# Altium schematic sheet MainSchematic.SchDoc
size A1; SheetNumber: 1; SheetTotal: 2
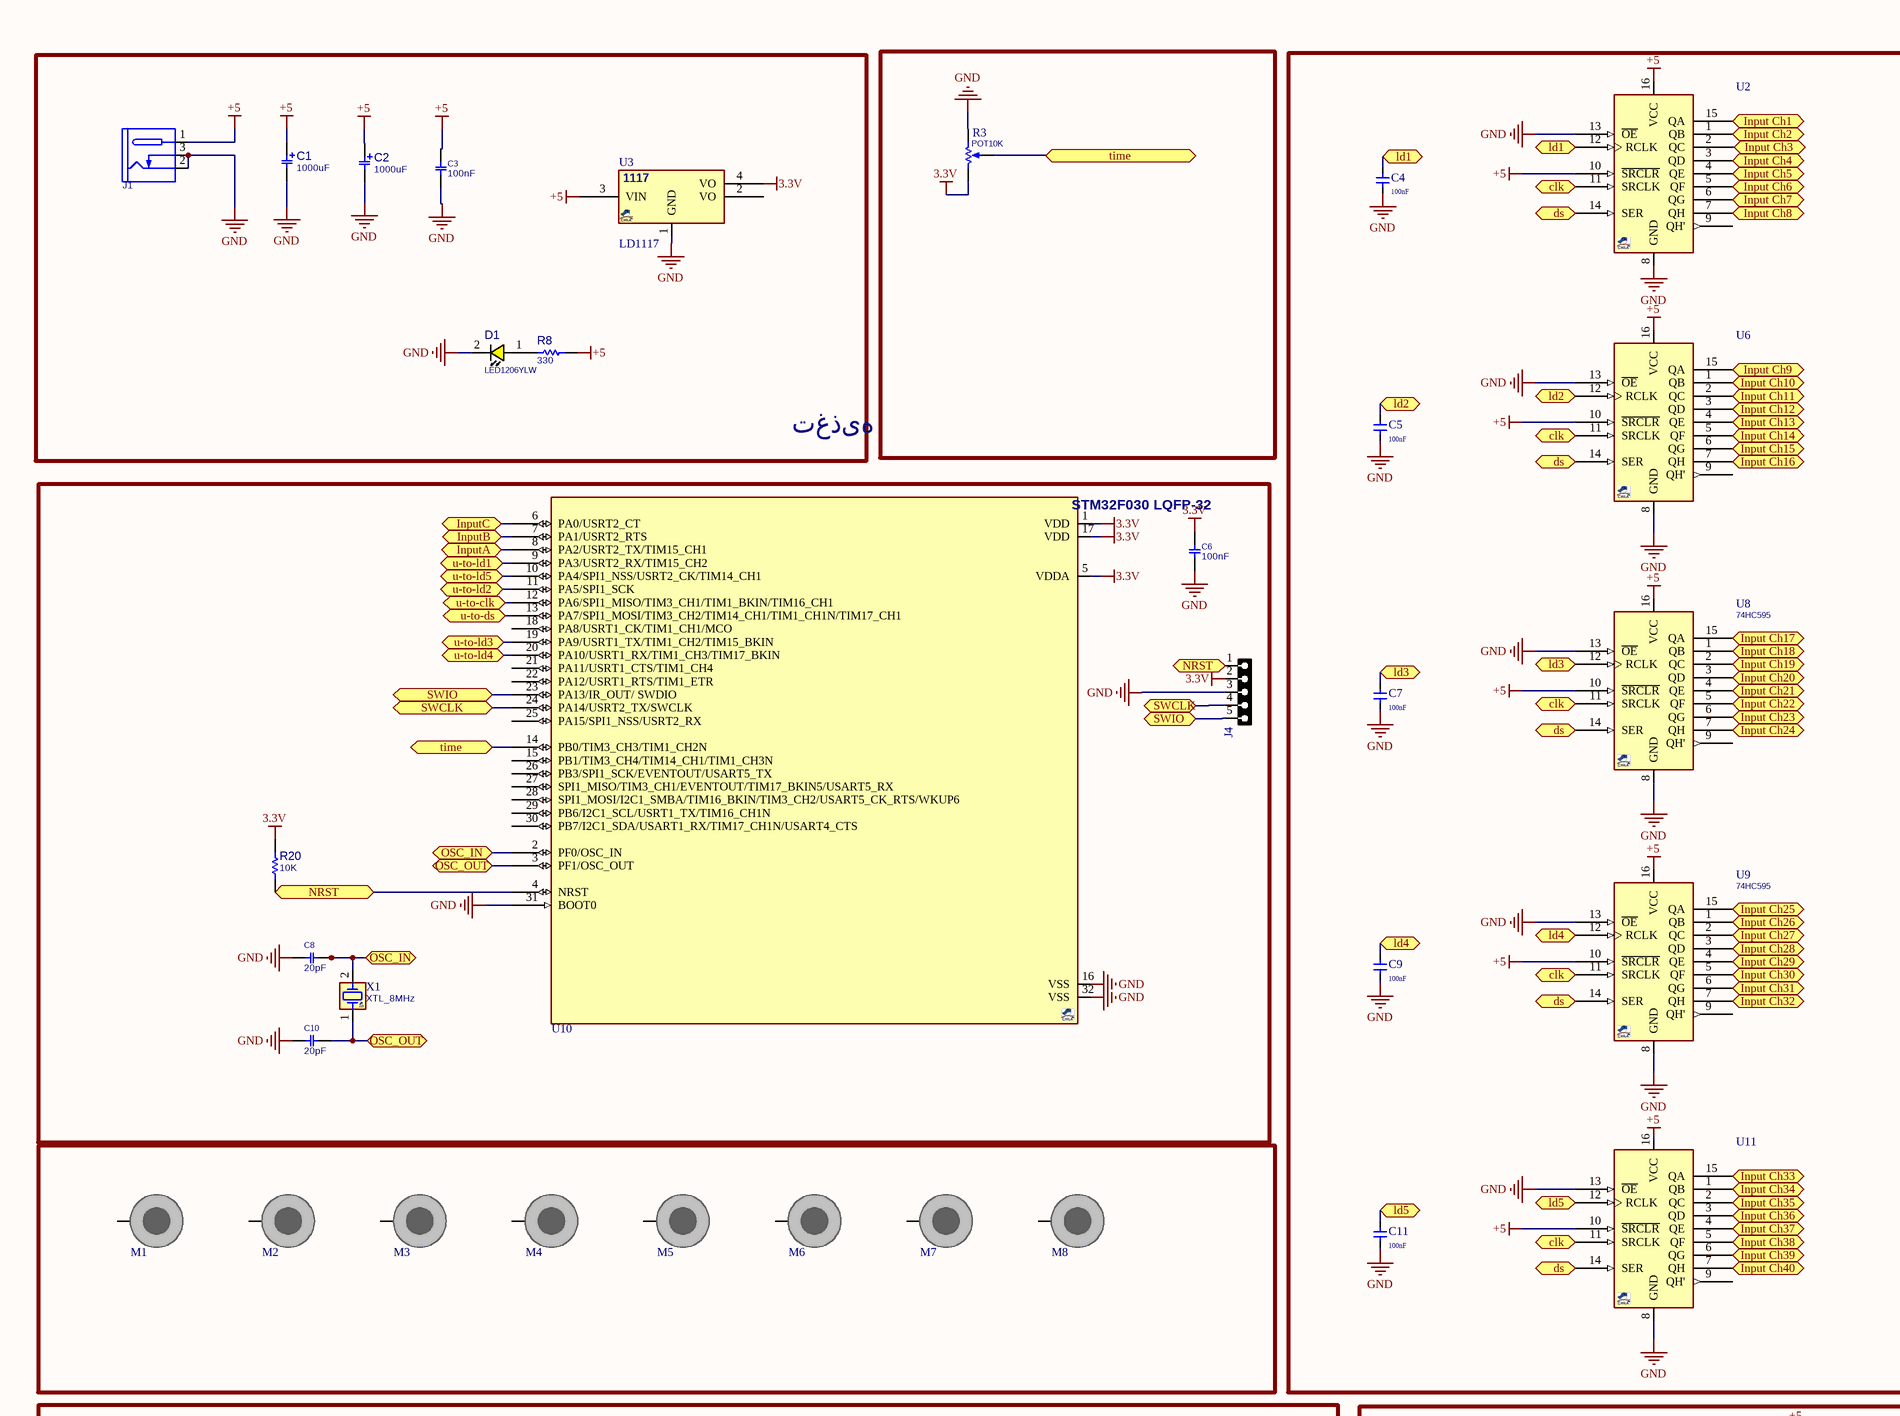
[diagram p0: MainSchematic.SchDoc, top left]
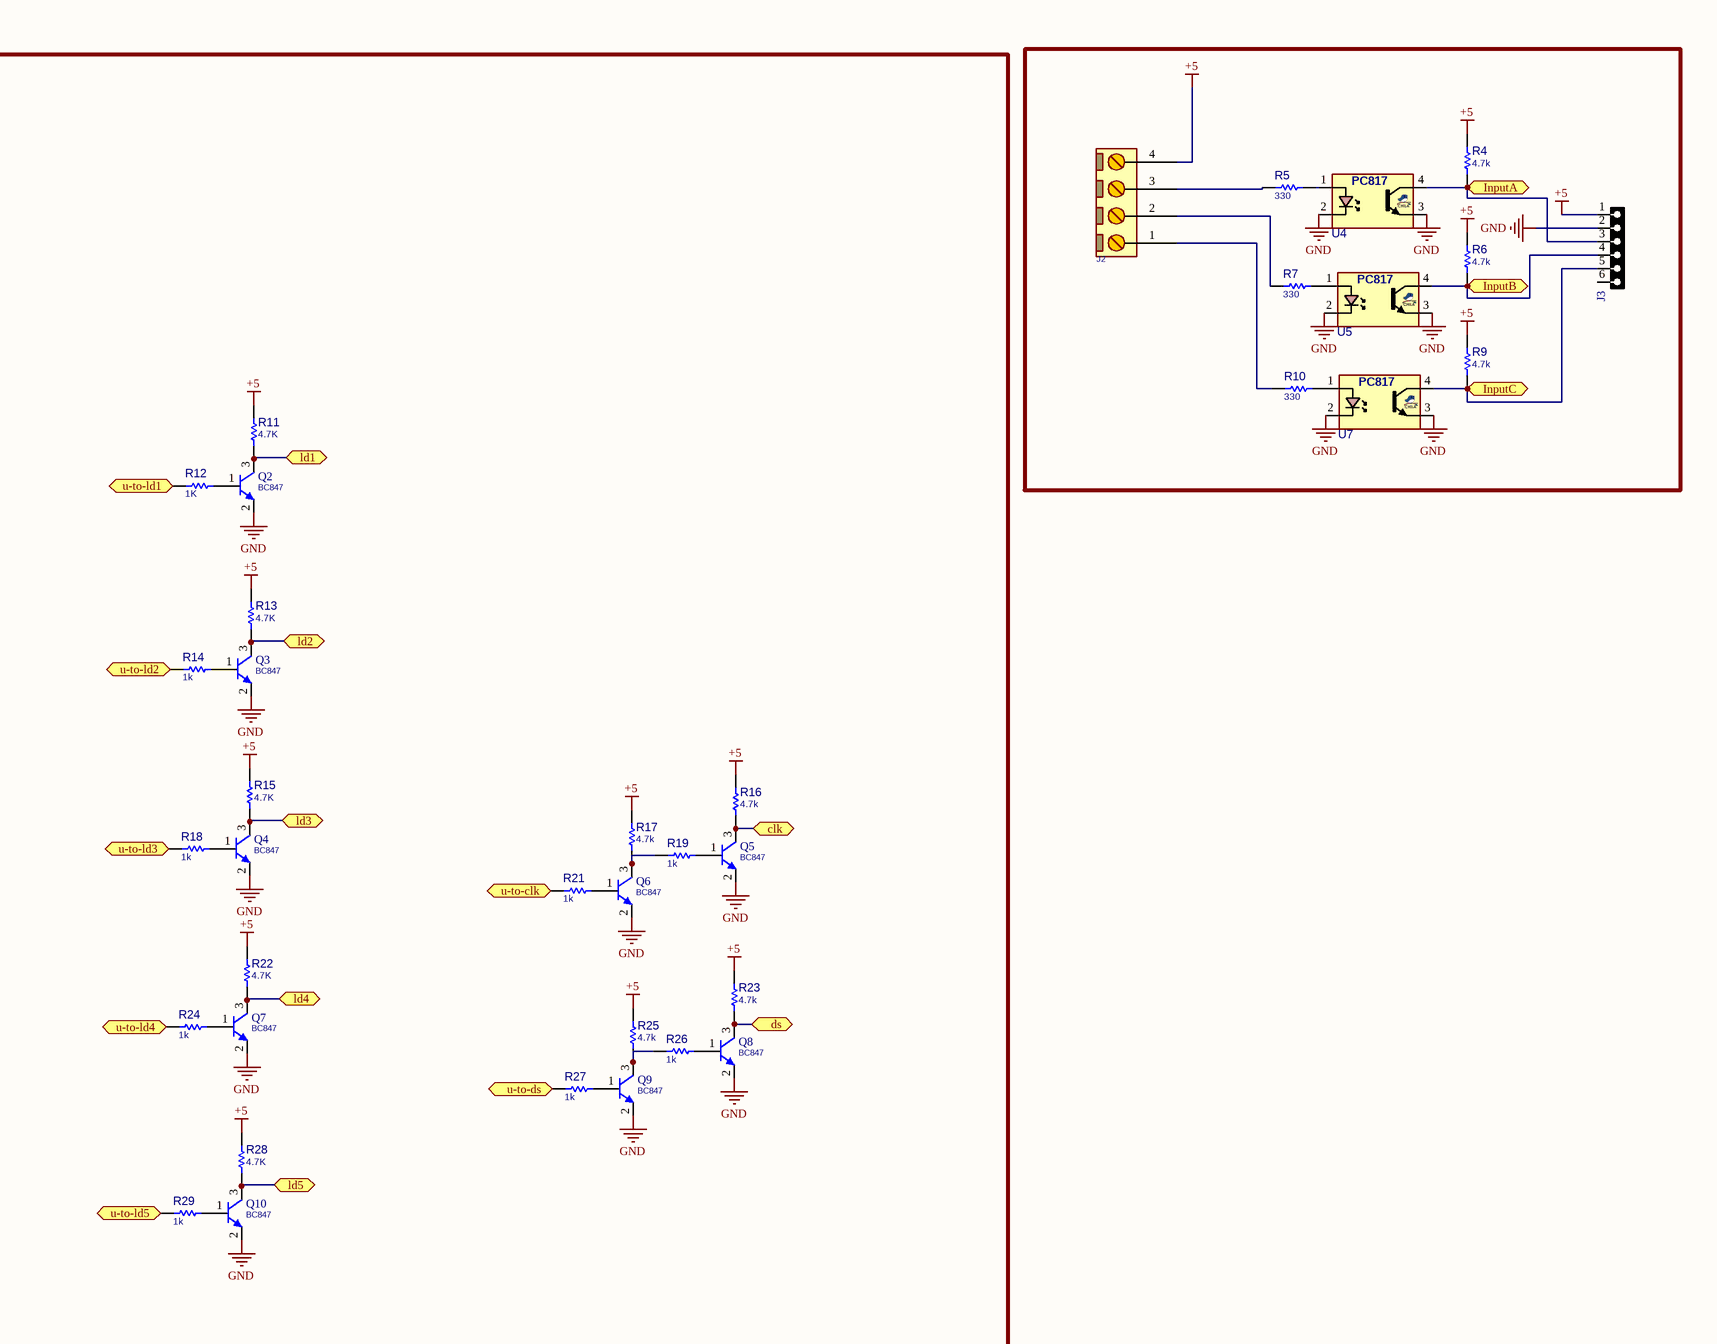
[diagram p1: MainSchematic.SchDoc, top right]
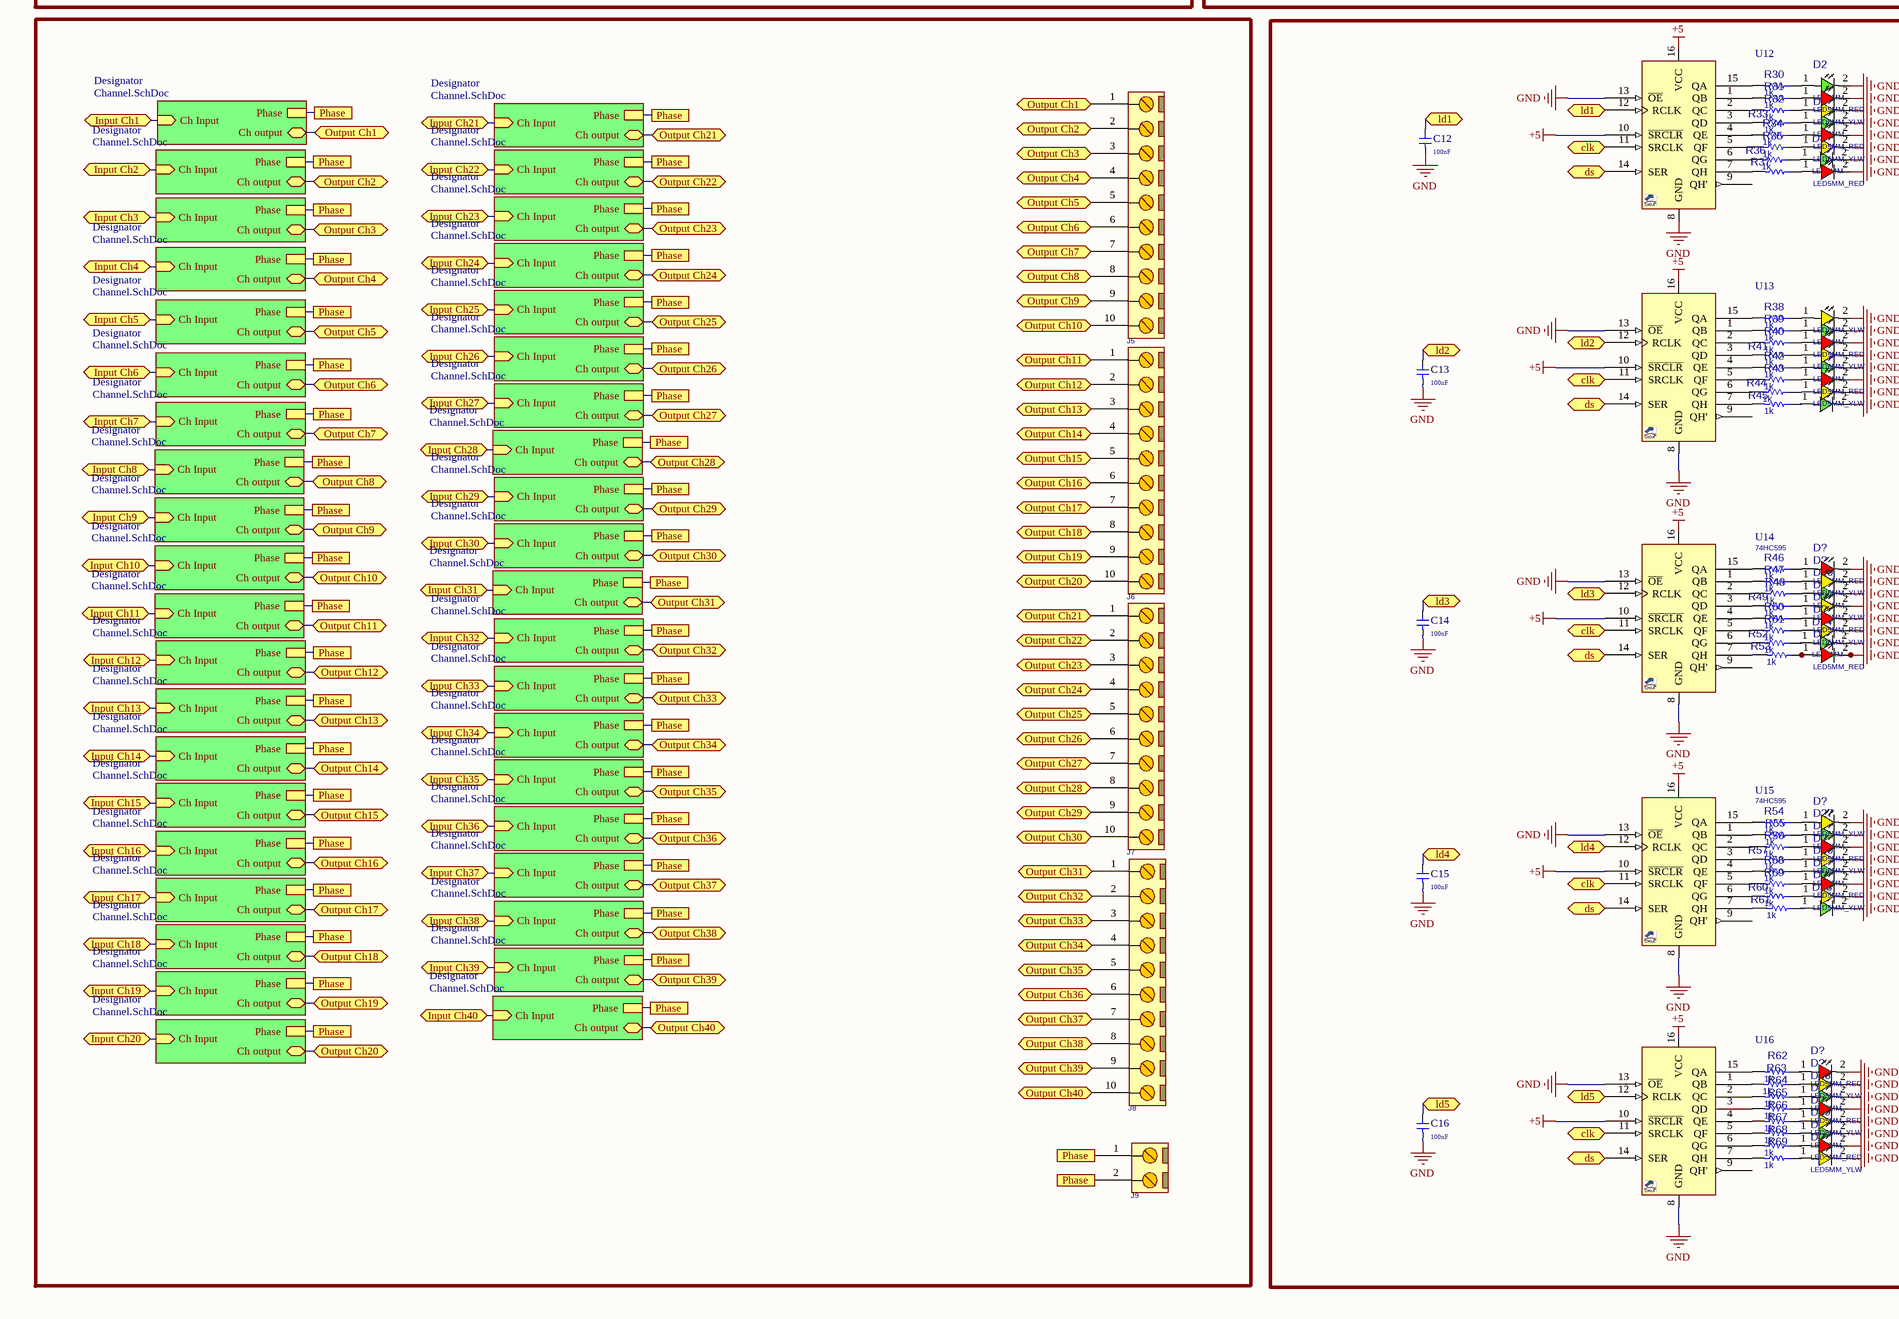
[diagram p2: MainSchematic.SchDoc, bottom left]

## Parts
(Parts that share a designator on the sheet are numbered #1, #2 ... from top to bottom, then left to right.)
C1  1000uF  [C_EL_D10L9]
C2  1000uF  [C_EL_D10L9]
C3  100nF  [C1206]
C4  value 100nF  [C1206]  (hidden comment: CAP SMD PACKAGE)
C5  value 100nF  [C1206]  (hidden comment: CAP SMD PACKAGE)
C6  100nF  [C1206]
C7  value 100nF  [C1206]  (hidden comment: CAP SMD PACKAGE)
C8  20pF  [C1206]
C9  value 100nF  [C1206]  (hidden comment: CAP SMD PACKAGE)
C10  20pF  [C1206]
C11  value 100nF  [C1206]  (hidden comment: CAP SMD PACKAGE)
C12  value 100nF  [C1206]  (hidden comment: CAP SMD PACKAGE)
C13  value 100nF  [C1206]  (hidden comment: CAP SMD PACKAGE)
C14  value 100nF  [C1206]  (hidden comment: CAP SMD PACKAGE)
C15  value 100nF  [C1206]  (hidden comment: CAP SMD PACKAGE)
C16  value 100nF  [C1206]  (hidden comment: CAP SMD PACKAGE)
D1  LED1206YLW  [LED1206YLW]
D2  LED3MM  [LED3MM]
D5  LED3MM  [LED3MM]
D8  LED3MM  [LED3MM]
D11  LED3MM  [LED3MM]
D14  LED3MM  [LED3MM]
D17  (no value)  [LED3MM]
D20  LED3MM  [LED3MM]
D24  LED3MM  [LED3MM]
D27  LED3MM  [LED3MM]
D30  LED3MM  [LED3MM]
D33  (no value)  [LED3MM]
D36  LED3MM  [LED3MM]
D39  LED3MM  [LED3MM]
D?#1  LED5MM_RED  [LED5MM_RED]
D?#2  LED5MM_YLW  [LED5MM_YLW]
D?#3  LED5MM_RED  [LED5MM_RED]
D?#4  LED5MM_YLW  [LED5MM_YLW]
D?#5  LED5MM_RED  [LED5MM_RED]
D?#6  LED5MM_YLW  [LED5MM_YLW]
D?#7  LED5MM_RED  [LED5MM_RED]
D?#8  LED5MM_YLW  [LED5MM_YLW]
D?#9  LED5MM_RED  [LED5MM_RED]
D?#10  LED5MM_YLW  [LED5MM_YLW]
D?#11  LED5MM_RED  [LED5MM_RED]
D?#12  LED5MM_YLW  [LED5MM_YLW]
D?#13  LED5MM_YLW  [LED5MM_YLW]
D?#14  LED5MM_RED  [LED5MM_RED]
D?#15  LED5MM_YLW  [LED5MM_YLW]
D?#16  LED5MM_RED  [LED5MM_RED]
D?#17  LED5MM_YLW  [LED5MM_YLW]
D?#18  LED5MM_RED  [LED5MM_RED]
D?#19  LED5MM_YLW  [LED5MM_YLW]
D?#20  LED5MM_RED  [LED5MM_RED]
D?#21  LED5MM_YLW  [LED5MM_YLW]
D?#22  LED5MM_RED  [LED5MM_RED]
D?#23  LED5MM_YLW  [LED5MM_YLW]
D?#24  LED5MM_RED  [LED5MM_RED]
D?#25  LED5MM_YLW  [LED5MM_YLW]
D?#26  LED5MM_RED  [LED5MM_RED]
D?#27  LED5MM_YLW  [LED5MM_YLW]
J1  DC_POWER_JACK  [JAC_PWR2]  (value not drawn)
J2  CONN_TB4  [MSTB_4]  (value not drawn)
J3  HDRF6  [HDR_F_1X6]  (value not drawn)
J4  HDRF5  [HDR_F_1X5]  (value not drawn)
J5  CONN_TB10  [MSTB_10]  (value not drawn)
J6  CONN_TB10  [MSTB_10]  (value not drawn)
J7  CONN_TB10  [MSTB_10]  (value not drawn)
J8  CONN_TB10  [MSTB_10]  (value not drawn)
J9  CONN_TB2  [MSTB_2]  (value not drawn)
M1  DNP/MH  [SCMH_M5FT]  (value not drawn)  (no BOM)
M2  DNP/MH  [SCMH_M5FT]  (value not drawn)  (no BOM)
M3  DNP/MH  [SCMH_M5FT]  (value not drawn)  (no BOM)
M4  DNP/MH  [SCMH_M5FT]  (value not drawn)  (no BOM)
M5  DNP/MH  [SCMH_M5FT]  (value not drawn)  (no BOM)
M6  DNP/MH  [SCMH_M5FT]  (value not drawn)  (no BOM)
M7  DNP/MH  [SCMH_M5FT]  (value not drawn)  (no BOM)
M8  DNP/MH  [SCMH_M5FT]  (value not drawn)  (no BOM)
Q2  BC847  [SOT23_3]
Q3  BC847  [SOT23_3]
Q4  BC847  [SOT23_3]
Q5  BC847  [SOT23_3]
Q6  BC847  [SOT23_3]
Q7  BC847  [SOT23_3]
Q8  BC847  [SOT23_3]
Q9  BC847  [SOT23_3]
Q10  BC847  [SOT23_3]
R3  POT10K  [POT_7X5]
R4  4.7k  [R1206]
R5  330  [R1206]
R6  4.7k  [R1206]
R7  330  [R1206]
R8  330  [R1206]
R9  4.7k  [R1206]
R10  330  [R1206]
R11  4.7K  [R1206]
R12  1K  [R1206]
R13  4.7K  [R1206]
R14  1k  [R1206]
R15  4.7K  [R1206]
R16  4.7k  [R1206]
R17  4.7k  [R1206]
R18  1k  [R1206]
R19  1k  [R1206]
R20  10K  [R1206]
R21  1k  [R1206]
R22  4.7K  [R1206]
R23  4.7k  [R1206]
R24  1k  [R1206]
R25  4.7k  [R1206]
R26  1k  [R1206]
R27  1k  [R1206]
R28  4.7K  [R1206]
R29  1k  [R1206]
R30  1k  [R1206]
R31  1k  [R1206]
R32  1k  [R1206]
R33  1k  [R1206]
R34  1k  [R1206]
R35  1k  [R1206]
R36  1k  [R1206]
R37  (no value)  [R1206]
R38  1k  [R1206]
R39  1k  [R1206]
R40  1k  [R1206]
R41  1k  [R1206]
R42  1k  [R1206]
R43  1k  [R1206]
R44  1k  [R1206]
R45  1k  [R1206]
R46  1k  [R1206]
R47  1k  [R1206]
R48  1k  [R1206]
R49  1k  [R1206]
R50  1k  [R1206]
R51  1k  [R1206]
R52  1k  [R1206]
R53  1k  [R1206]
R54  1k  [R1206]
R55  1k  [R1206]
R56  1k  [R1206]
R57  1k  [R1206]
R58  1k  [R1206]
R59  1k  [R1206]
R60  1k  [R1206]
R61  1k  [R1206]
R62  1k  [R1206]
R63  1k  [R1206]
R64  1k  [R1206]
R65  1k  [R1206]
R66  1k  [R1206]
R67  1k  [R1206]
R68  1k  [R1206]
R69  1k  [R1206]
U2  (no value)  [SO_16]
U3  LD1117  [DPAK_3]
U4  PC817  [DIP_4]  (value not drawn)
U5  PC817  [DIP_4]  (value not drawn)
U6  (no value)  [SO_16]
U7  PC817  [DIP_4]  (value not drawn)
U8  74HC595  [SO_16]
U9  74HC595  [SO_16]
U10  STM32F030  [QFG80_32]  (value not drawn)
U11  (no value)  [SO_16]
U12  (no value)  [SO_16]
U13  (no value)  [SO_16]
U14  74HC595  [SO_16]
U15  74HC595  [SO_16]
U16  (no value)  [SO_16]
X1  XTL_8MHz  [XTL_2_11X5]

## Blocks framed on the sheet
تغذیه: C1-C3 D1 J1 R8 U3

## Sub-sheets
Designator = Channel.SchDoc: Ch Input (in), Phase, Ch output (bidir)
Designator = Channel.SchDoc: Ch Input (in), Phase, Ch output (bidir)
Designator = Channel.SchDoc: Ch Input (in), Phase, Ch output (bidir)
Designator = Channel.SchDoc: Ch Input (in), Phase, Ch output (bidir)
Designator = Channel.SchDoc: Ch Input (in), Phase, Ch output (bidir)
Designator = Channel.SchDoc: Ch Input (in), Phase, Ch output (bidir)
Designator = Channel.SchDoc: Ch Input (in), Phase, Ch output (bidir)
Designator = Channel.SchDoc: Ch Input (in), Phase, Ch output (bidir)
Designator = Channel.SchDoc: Ch Input (in), Phase, Ch output (bidir)
Designator = Channel.SchDoc: Ch Input (in), Phase, Ch output (bidir)
Designator = Channel.SchDoc: Ch Input (in), Phase, Ch output (bidir)
Designator = Channel.SchDoc: Ch Input (in), Phase, Ch output (bidir)
Designator = Channel.SchDoc: Ch Input (in), Phase, Ch output (bidir)
Designator = Channel.SchDoc: Ch Input (in), Phase, Ch output (bidir)
Designator = Channel.SchDoc: Ch Input (in), Phase, Ch output (bidir)
Designator = Channel.SchDoc: Ch Input (in), Phase, Ch output (bidir)
Designator = Channel.SchDoc: Ch Input (in), Phase, Ch output (bidir)
Designator = Channel.SchDoc: Ch Input (in), Phase, Ch output (bidir)
Designator = Channel.SchDoc: Ch Input (in), Phase, Ch output (bidir)
Designator = Channel.SchDoc: Ch Input (in), Phase, Ch output (bidir)
Designator = Channel.SchDoc: Ch Input (in), Phase, Ch output (bidir)
Designator = Channel.SchDoc: Ch Input (in), Phase, Ch output (bidir)
Designator = Channel.SchDoc: Ch Input (in), Phase, Ch output (bidir)
Designator = Channel.SchDoc: Ch Input (in), Phase, Ch output (bidir)
Designator = Channel.SchDoc: Ch Input (in), Phase, Ch output (bidir)
Designator = Channel.SchDoc: Ch Input (in), Phase, Ch output (bidir)
Designator = Channel.SchDoc: Ch Input (in), Phase, Ch output (bidir)
Designator = Channel.SchDoc: Ch Input (in), Phase, Ch output (bidir)
Designator = Channel.SchDoc: Ch Input (in), Phase, Ch output (bidir)
Designator = Channel.SchDoc: Ch Input (in), Phase, Ch output (bidir)
Designator = Channel.SchDoc: Ch Input (in), Phase, Ch output (bidir)
Designator = Channel.SchDoc: Ch Input (in), Phase, Ch output (bidir)
Designator = Channel.SchDoc: Ch Input (in), Phase, Ch output (bidir)
Designator = Channel.SchDoc: Ch Input (in), Phase, Ch output (bidir)
Designator = Channel.SchDoc: Ch Input (in), Phase, Ch output (bidir)
Designator = Channel.SchDoc: Ch Input (in), Phase, Ch output (bidir)
Designator = Channel.SchDoc: Ch Input (in), Phase, Ch output (bidir)
Designator = Channel.SchDoc: Ch Input (in), Phase, Ch output (bidir)
Designator = Channel.SchDoc: Ch Input (in), Phase, Ch output (bidir)
Designator = Channel.SchDoc: Ch Input (in), Phase, Ch output (bidir)

## Ports
clk (bidir), ds (bidir), Input Ch1 (bidir), Input Ch2 (bidir), Input Ch3 (bidir), Input Ch4 (bidir), Input Ch5 (bidir), Input Ch6 (bidir), Input Ch7 (bidir), Input Ch8 (bidir), Input Ch9 (bidir), Input Ch10 (bidir), Input Ch11 (bidir), Input Ch12 (bidir), Input Ch13 (bidir), Input Ch14 (bidir), Input Ch15 (bidir), Input Ch16 (bidir), Input Ch17 (bidir), Input Ch18 (bidir), Input Ch19 (bidir), Input Ch20 (bidir), Input Ch21 (bidir), Input Ch22 (bidir), Input Ch23 (bidir), Input Ch24 (bidir), Input Ch25 (bidir), Input Ch26 (bidir), Input Ch27 (bidir), Input Ch28 (bidir), Input Ch29 (bidir), Input Ch30 (bidir), Input Ch31 (bidir), Input Ch32 (bidir), Input Ch33 (bidir), Input Ch34 (bidir), Input Ch35 (bidir), Input Ch36 (bidir), Input Ch37 (bidir), Input Ch38 (bidir), Input Ch39 (bidir), Input Ch40 (bidir), InputA (bidir), InputB (bidir), InputC (bidir), ld1 (bidir), ld2 (bidir), ld3 (bidir), ld4 (bidir), ld5 (bidir), NRST (bidir), OSC_IN (bidir), OSC_OUT (bidir), Output Ch1 (bidir), Output Ch2 (bidir), Output Ch3 (bidir), Output Ch4 (bidir), Output Ch5 (bidir), Output Ch6 (bidir), Output Ch7 (bidir), Output Ch8 (bidir), Output Ch9 (bidir), Output Ch10 (bidir), Output Ch11 (bidir), Output Ch12 (bidir), Output Ch13 (bidir), Output Ch14 (bidir), Output Ch15 (bidir), Output Ch16 (bidir), Output Ch17 (bidir), Output Ch18 (bidir), Output Ch19 (bidir), Output Ch20 (bidir), Output Ch21 (bidir), Output Ch22 (bidir), Output Ch23 (bidir), Output Ch24 (bidir), Output Ch25 (bidir), Output Ch26 (bidir), Output Ch27 (bidir), Output Ch28 (bidir), Output Ch29 (bidir), Output Ch30 (bidir), Output Ch31 (bidir), Output Ch32 (bidir), Output Ch33 (bidir), Output Ch34 (bidir), Output Ch35 (bidir), Output Ch36 (bidir), Output Ch37 (bidir), Output Ch38 (bidir), Output Ch39 (bidir), Output Ch40 (bidir), Phase, SWCLK (bidir), SWIO (bidir), time (bidir), u-to-clk (bidir), u-to-ds (bidir), u-to-ld1 (bidir), u-to-ld2 (bidir), u-to-ld3 (bidir), u-to-ld4 (bidir), u-to-ld5 (bidir)

## Nets
3.3V: C6.2 J4.2 R3.3(BOT) R20.2 U3.4(VO) U10.1(VDD) U10.5(VDDA) U10.17(VDD)
+5: C1.1 C2.1 C3.2 J1.1(TIP) J2.4 J3.1 R4.1 R6.1 R8.2 R9.1 R11.1 R13.1 R15.1 R16.1 R17.1 R22.1 R23.1 R25.1 R28.1 U2.10(~{SRCLR}) U2.16(VCC) U3.3(VIN) U6.10(~{SRCLR}) U6.16(VCC) U8.10(~{SRCLR}) U8.16(VCC) U9.10(~{SRCLR}) U9.16(VCC) U11.10(~{SRCLR}) U11.16(VCC) U12.10(~{SRCLR}) U12.16(VCC) U13.10(~{SRCLR}) U13.16(VCC) U14.10(~{SRCLR}) U14.16(VCC) U15.10(~{SRCLR}) U15.16(VCC) U16.10(~{SRCLR}) U16.16(VCC)
GND: C1.2 C2.2 C3.1 C4.1 C5.1 C6.1 C7.1 C8.2 C9.1 C10.2 C11.1 C12.1 C13.1 C14.1 C15.1 C16.1 D1.2(CATHODE) D2.2(CATHODE) D5.2(CATHODE) D8.2(CATHODE) D11.2(CATHODE) D14.2(CATHODE) D17.2(CATHODE) D20.2(CATHODE) D24.2(CATHODE) D27.2(CATHODE) D30.2(CATHODE) D33.2(CATHODE) D36.2(CATHODE) D39.2(CATHODE) D?#1.2(CATHODE) D?#2.2(CATHODE) D?#3.2(CATHODE) D?#4.2(CATHODE) D?#5.2(CATHODE) D?#6.2(CATHODE) D?#7.2(CATHODE) D?#8.2(CATHODE) D?#9.2(CATHODE) D?#10.2(CATHODE) D?#11.2(CATHODE) D?#12.2(CATHODE) D?#13.2(CATHODE) D?#14.2(CATHODE) D?#15.2(CATHODE) D?#16.2(CATHODE) D?#17.2(CATHODE) D?#18.2(CATHODE) D?#19.2(CATHODE) D?#20.2(CATHODE) D?#21.2(CATHODE) D?#22.2(CATHODE) D?#23.2(CATHODE) D?#24.2(CATHODE) D?#25.2(CATHODE) D?#26.2(CATHODE) D?#27.2(CATHODE) J1.2(SLEEVE) J1.3(INSERTION_DET) J3.2 J4.3 Q2.2(E) Q3.2(E) Q4.2(E) Q5.2(E) Q6.2(E) Q7.2(E) Q8.2(E) Q9.2(E) Q10.2(E) R3.1(TOP) U2.8(GND) U2.13(~{OE}) U3.1(GND) U4.2(K) U4.3(E) U5.2(K) U5.3(E) U6.8(GND) U6.13(~{OE}) U7.2(K) U7.3(E) U8.8(GND) U8.13(~{OE}) U9.8(GND) U9.13(~{OE}) U10.16(VSS) U10.31(BOOT0) U10.32(VSS) U11.8(GND) U11.13(~{OE}) U12.8(GND) U12.13(~{OE}) U13.8(GND) U13.13(~{OE}) U14.8(GND) U14.13(~{OE}) U15.8(GND) U15.13(~{OE}) U16.8(GND) U16.13(~{OE})
clk: Q5.3(C) R16.2 U2.11(SRCLK) U6.11(SRCLK) U8.11(SRCLK) U9.11(SRCLK) U11.11(SRCLK) U12.11(SRCLK) U13.11(SRCLK) U14.11(SRCLK) U15.11(SRCLK) U16.11(SRCLK) ; port clk
ds: Q8.3(C) R23.2 U2.14(SER) U6.14(SER) U8.14(SER) U9.14(SER) U11.14(SER) U12.14(SER) U13.14(SER) U14.14(SER) U15.14(SER) U16.14(SER) ; port ds
Input Ch1: U2.15(QA) ; port Input Ch1, sheet Designator/Ch Input
Input Ch2: U2.1(QB) ; port Input Ch2, sheet Designator/Ch Input
Input Ch3: U2.2(QC) ; port Input Ch3, sheet Designator/Ch Input
Input Ch4: U2.3(QD) ; port Input Ch4, sheet Designator/Ch Input
Input Ch5: U2.4(QE) ; port Input Ch5, sheet Designator/Ch Input
Input Ch6: U2.5(QF) ; port Input Ch6, sheet Designator/Ch Input
Input Ch7: U2.6(QG) ; port Input Ch7, sheet Designator/Ch Input
Input Ch8: U2.7(QH) ; port Input Ch8, sheet Designator/Ch Input
Input Ch9: U6.15(QA) ; port Input Ch9, sheet Designator/Ch Input
Input Ch10: U6.1(QB) ; port Input Ch10, sheet Designator/Ch Input
Input Ch11: U6.2(QC) ; port Input Ch11, sheet Designator/Ch Input
Input Ch12: U6.3(QD) ; port Input Ch12, sheet Designator/Ch Input
Input Ch13: U6.4(QE) ; port Input Ch13, sheet Designator/Ch Input
Input Ch14: U6.5(QF) ; port Input Ch14, sheet Designator/Ch Input
Input Ch15: U6.6(QG) ; port Input Ch15, sheet Designator/Ch Input
Input Ch16: U6.7(QH) ; port Input Ch16, sheet Designator/Ch Input
Input Ch17: U8.15(QA) ; port Input Ch17, sheet Designator/Ch Input
Input Ch18: U8.1(QB) ; port Input Ch18, sheet Designator/Ch Input
Input Ch19: U8.2(QC) ; port Input Ch19, sheet Designator/Ch Input
Input Ch20: U8.3(QD) ; port Input Ch20, sheet Designator/Ch Input
Input Ch21: U8.4(QE) ; port Input Ch21, sheet Designator/Ch Input
Input Ch22: U8.5(QF) ; port Input Ch22, sheet Designator/Ch Input
Input Ch23: U8.6(QG) ; port Input Ch23, sheet Designator/Ch Input
Input Ch24: U8.7(QH) ; port Input Ch24, sheet Designator/Ch Input
Input Ch25: U9.15(QA) ; port Input Ch25, sheet Designator/Ch Input
Input Ch26: U9.1(QB) ; port Input Ch26, sheet Designator/Ch Input
Input Ch27: U9.2(QC) ; port Input Ch27, sheet Designator/Ch Input
Input Ch28: U9.3(QD) ; port Input Ch28, sheet Designator/Ch Input
Input Ch29: U9.4(QE) ; port Input Ch29, sheet Designator/Ch Input
Input Ch30: U9.5(QF) ; port Input Ch30, sheet Designator/Ch Input
Input Ch31: U9.6(QG) ; port Input Ch31, sheet Designator/Ch Input
Input Ch32: U9.7(QH) ; port Input Ch32, sheet Designator/Ch Input
Input Ch33: U11.15(QA) ; port Input Ch33, sheet Designator/Ch Input
Input Ch34: U11.1(QB) ; port Input Ch34, sheet Designator/Ch Input
Input Ch35: U11.2(QC) ; port Input Ch35, sheet Designator/Ch Input
Input Ch36: U11.3(QD) ; port Input Ch36, sheet Designator/Ch Input
Input Ch37: U11.4(QE) ; port Input Ch37, sheet Designator/Ch Input
Input Ch38: U11.5(QF) ; port Input Ch38, sheet Designator/Ch Input
Input Ch39: U11.6(QG) ; port Input Ch39, sheet Designator/Ch Input
Input Ch40: U11.7(QH) ; port Input Ch40, sheet Designator/Ch Input
InputA: J3.3 R4.2 U4.4(C) U10.8(PA2/USRT2_TX/TIM15_CH1) ; port InputA
InputB: J3.4 R6.2 U5.4(C) U10.7(PA1/USRT2_RTS) ; port InputB
InputC: J3.5 R9.2 U7.4(C) U10.6(PA0/USRT2_CT) ; port InputC
ld1: C4.2 C12.2 Q2.3(C) R11.2 U2.12(RCLK) U12.12(RCLK) ; port ld1
ld2: C5.2 C13.2 Q3.3(C) R13.2 U6.12(RCLK) U13.12(RCLK) ; port ld2
ld3: C7.2 C14.2 Q4.3(C) R15.2 U8.12(RCLK) U14.12(RCLK) ; port ld3
ld4: C9.2 C15.2 Q7.3(C) R22.2 U9.12(RCLK) U15.12(RCLK) ; port ld4
ld5: C11.2 C16.2 Q10.3(C) R28.2 U11.12(RCLK) U16.12(RCLK) ; port ld5
NRST: J4.1 R20.1 U10.4(NRST) ; port NRST
OSC_IN: C8.1 U10.2(PF0/OSC_IN) X1.2(OSC2) ; port OSC_IN
OSC_OUT: C10.1 U10.3(PF1/OSC_OUT) X1.1(OSC1) ; port OSC_OUT
Output Ch1: J5.1 ; port Output Ch1, sheet Designator/Ch output
Output Ch2: J5.2 ; port Output Ch2, sheet Designator/Ch output
Output Ch3: J5.3 ; port Output Ch3, sheet Designator/Ch output
Output Ch4: J5.4 ; port Output Ch4, sheet Designator/Ch output
Output Ch5: J5.5 ; port Output Ch5, sheet Designator/Ch output
Output Ch6: J5.6 ; port Output Ch6, sheet Designator/Ch output
Output Ch7: J5.7 ; port Output Ch7, sheet Designator/Ch output
Output Ch8: J5.8 ; port Output Ch8, sheet Designator/Ch output
Output Ch9: J5.9 ; port Output Ch9, sheet Designator/Ch output
Output Ch10: J5.10 ; port Output Ch10, sheet Designator/Ch output
Output Ch11: J6.1 ; port Output Ch11, sheet Designator/Ch output
Output Ch12: J6.2 ; port Output Ch12, sheet Designator/Ch output
Output Ch13: J6.3 ; port Output Ch13, sheet Designator/Ch output
Output Ch14: J6.4 ; port Output Ch14, sheet Designator/Ch output
Output Ch15: J6.5 ; port Output Ch15, sheet Designator/Ch output
Output Ch16: J6.6 ; port Output Ch16, sheet Designator/Ch output
Output Ch17: J6.7 ; port Output Ch17, sheet Designator/Ch output
Output Ch18: J6.8 ; port Output Ch18, sheet Designator/Ch output
Output Ch19: J6.9 ; port Output Ch19, sheet Designator/Ch output
Output Ch20: J6.10 ; port Output Ch20, sheet Designator/Ch output
Output Ch21: J7.1 ; port Output Ch21, sheet Designator/Ch output
Output Ch22: J7.2 ; port Output Ch22, sheet Designator/Ch output
Output Ch23: J7.3 ; port Output Ch23, sheet Designator/Ch output
Output Ch24: J7.4 ; port Output Ch24, sheet Designator/Ch output
Output Ch25: J7.5 ; port Output Ch25, sheet Designator/Ch output
Output Ch26: J7.6 ; port Output Ch26, sheet Designator/Ch output
Output Ch27: J7.7 ; port Output Ch27, sheet Designator/Ch output
Output Ch28: J7.8 ; port Output Ch28, sheet Designator/Ch output
Output Ch29: J7.9 ; port Output Ch29, sheet Designator/Ch output
Output Ch30: J7.10 ; port Output Ch30, sheet Designator/Ch output
Output Ch31: J8.1 ; port Output Ch31, sheet Designator/Ch output
Output Ch32: J8.2 ; port Output Ch32, sheet Designator/Ch output
Output Ch33: J8.3 ; port Output Ch33, sheet Designator/Ch output
Output Ch34: J8.4 ; port Output Ch34, sheet Designator/Ch output
Output Ch35: J8.5 ; port Output Ch35, sheet Designator/Ch output
Output Ch36: J8.6 ; port Output Ch36, sheet Designator/Ch output
Output Ch37: J8.7 ; port Output Ch37, sheet Designator/Ch output
Output Ch38: J8.8 ; port Output Ch38, sheet Designator/Ch output
Output Ch39: J8.9 ; port Output Ch39, sheet Designator/Ch output
Output Ch40: J8.10 ; port Output Ch40, sheet Designator/Ch output
Phase: J9.1 J9.2 ; port Phase, sheet Designator/Phase, sheet Designator/Phase, sheet Designator/Phase, sheet Designator/Phase, sheet Designator/Phase, sheet Designator/Phase, sheet Designator/Phase, sheet Designator/Phase, sheet Designator/Phase, sheet Designator/Phase, sheet Designator/Phase, sheet Designator/Phase, sheet Designator/Phase, sheet Designator/Phase, sheet Designator/Phase, sheet Designator/Phase, sheet Designator/Phase, sheet Designator/Phase, sheet Designator/Phase, sheet Designator/Phase, sheet Designator/Phase, sheet Designator/Phase, sheet Designator/Phase, sheet Designator/Phase, sheet Designator/Phase, sheet Designator/Phase, sheet Designator/Phase, sheet Designator/Phase, sheet Designator/Phase, sheet Designator/Phase, sheet Designator/Phase, sheet Designator/Phase, sheet Designator/Phase, sheet Designator/Phase, sheet Designator/Phase, sheet Designator/Phase, sheet Designator/Phase, sheet Designator/Phase, sheet Designator/Phase, sheet Designator/Phase
SWCLK: J4.4 U10.24(PA14/USRT2_TX/SWCLK) ; port SWCLK
SWIO: J4.5 U10.23(PA13/IR_OUT/_SWDIO) ; port SWIO
time: R3.2(TAP) U10.14(PB0/TIM3_CH3/TIM1_CH2N) ; port time
u-to-clk: R21.2 U10.12(PA6/SPI1_MISO/TIM3_CH1/TIM1_BKIN/TIM16_CH1) ; port u-to-clk
u-to-ds: R27.2 U10.13(PA7/SPI1_MOSI/TIM3_CH2/TIM14_CH1/TIM1_CH1N/TIM17_CH1) ; port u-to-ds
u-to-ld1: R12.2 U10.9(PA3/USRT2_RX/TIM15_CH2) ; port u-to-ld1
u-to-ld2: R14.2 U10.11(PA5/SPI1_SCK) ; port u-to-ld2
u-to-ld3: R18.2 U10.19(PA9/USRT1_TX/TIM1_CH2/TIM15_BKIN) ; port u-to-ld3
u-to-ld4: R24.2 U10.20(PA10/USRT1_RX/TIM1_CH3/TIM17_BKIN) ; port u-to-ld4
u-to-ld5: R29.2 U10.10(PA4/SPI1_NSS/USRT2_CK/TIM14_CH1) ; port u-to-ld5
NetD1_1: D1.1(ANODE) R8.1
NetD2_1: D2.1(ANODE) R30.1
NetD5_1: D5.1(ANODE) R33.1
NetD8_1: D8.1(ANODE) R36.1
NetD11_1: D11.1(ANODE) R39.1
NetD14_1: D14.1(ANODE) R42.1
NetD17_1: D17.1(ANODE) R45.1
NetD20_1: D20.1(ANODE) R48.1
NetD24_1: D24.1(ANODE) R52.1
NetD27_1: D27.1(ANODE) R55.1
NetD30_1: D30.1(ANODE) R58.1
NetD33_1: D33.1(ANODE) R61.1
NetD36_1: D36.1(ANODE) R64.1
NetD39_1: D39.1(ANODE) R67.1
NetD?#1_1: D?#1.1(ANODE) R31.1
NetD?#2_1: D?#2.1(ANODE) R32.1
NetD?#3_1: D?#3.1(ANODE) R34.1
NetD?#4_1: D?#4.1(ANODE) R35.1
NetD?#5_1: D?#5.1(ANODE) R37.1
NetD?#6_1: D?#6.1(ANODE) R38.1
NetD?#7_1: D?#7.1(ANODE) R40.1
NetD?#8_1: D?#8.1(ANODE) R41.1
NetD?#9_1: D?#9.1(ANODE) R43.1
NetD?#10_1: D?#10.1(ANODE) R44.1
NetD?#11_1: D?#11.1(ANODE) R46.1
NetD?#12_1: D?#12.1(ANODE) R47.1
NetD?#13_1: D?#13.1(ANODE) R49.1
NetD?#14_1: D?#14.1(ANODE) R50.1
NetD?#15_1: D?#15.1(ANODE) R51.1
NetD?#16_1: D?#16.1(ANODE) R53.1
NetD?#17_1: D?#17.1(ANODE) R54.1
NetD?#18_1: D?#18.1(ANODE) R56.1
NetD?#19_1: D?#19.1(ANODE) R57.1
NetD?#20_1: D?#20.1(ANODE) R59.1
NetD?#21_1: D?#21.1(ANODE) R60.1
NetD?#22_1: D?#22.1(ANODE) R62.1
NetD?#23_1: D?#23.1(ANODE) R63.1
NetD?#24_1: D?#24.1(ANODE) R65.1
NetD?#25_1: D?#25.1(ANODE) R66.1
NetD?#26_1: D?#26.1(ANODE) R68.1
NetD?#27_1: D?#27.1(ANODE) R69.1
NetJ2_1: J2.1 R10.2
NetJ2_2: J2.2 R7.2
NetJ2_3: J2.3 R5.1
NetQ2_1: Q2.1(B) R12.1
NetQ3_1: Q3.1(B) R14.1
NetQ4_1: Q4.1(B) R18.1
NetQ5_1: Q5.1(B) R19.1
NetQ6_1: Q6.1(B) R21.1
NetQ6_3: Q6.3(C) R17.2 R19.2
NetQ7_1: Q7.1(B) R24.1
NetQ8_1: Q8.1(B) R26.1
NetQ9_1: Q9.1(B) R27.1
NetQ9_3: Q9.3(C) R25.2 R26.2
NetQ10_1: Q10.1(B) R29.1
NetR5_2: R5.2 U4.1(A)
NetR7_1: R7.1 U5.1(A)
NetR10_1: R10.1 U7.1(A)
NetR30_2: R30.2 U12.15(QA)
NetR31_2: R31.2 U12.1(QB)
NetR32_2: R32.2 U12.2(QC)
NetR33_2: R33.2 U12.3(QD)
NetR34_2: R34.2 U12.4(QE)
NetR35_2: R35.2 U12.5(QF)
NetR37_2: R37.2 U12.7(QH)
NetR38_2: R38.2 U13.15(QA)
NetR39_2: R39.2 U13.1(QB)
NetR40_2: R40.2 U13.2(QC)
NetR41_2: R41.2 U13.3(QD)
NetR42_2: R42.2 U13.4(QE)
NetR43_2: R43.2 U13.5(QF)
NetR44_2: R44.2 U13.6(QG)
NetR45_2: R45.2 U13.7(QH)
NetR46_2: R46.2 U14.15(QA)
NetR47_2: R47.2 U14.1(QB)
NetR48_2: R48.2 U14.2(QC)
NetR49_2: R49.2 U14.3(QD)
NetR50_2: R50.2 U14.4(QE)
NetR51_2: R51.2 U14.5(QF)
NetR52_2: R52.2 U14.6(QG)
NetR53_2: R53.2 U14.7(QH)
NetR54_2: R54.2 U15.15(QA)
NetR55_2: R55.2 U15.1(QB)
NetR56_2: R56.2 U15.2(QC)
NetR57_2: R57.2 U15.3(QD)
NetR58_2: R58.2 U15.4(QE)
NetR59_2: R59.2 U15.5(QF)
NetR60_2: R60.2 U15.6(QG)
NetR61_2: R61.2 U15.7(QH)
NetR62_2: R62.2 U16.15(QA)
NetR63_2: R63.2 U16.1(QB)
NetR64_2: R64.2 U16.2(QC)
NetR65_2: R65.2 U16.3(QD)
NetR66_2: R66.2 U16.4(QE)
NetR67_2: R67.2 U16.5(QF)
NetR68_2: R68.2 U16.6(QG)
NetR69_2: R69.2 U16.7(QH)

Not connected (* = marked no-connect by the designer): J3 6; M1 1; M2 1; M3 1; M4 1; M5 1; M6 1; M7 1; M8 1; R36 2; U2 9(QH'); U3 2(VO); U6 9(QH'); U8 9(QH'); U9 9(QH'); U10 15(PB1/TIM3_CH4/TIM14_CH1/TIM1_CH3N) 18(PA8/USRT1_CK/TIM1_CH1/MCO) 21(PA11/USRT1_CTS/TIM1_CH4) 22(PA12/USRT1_RTS/TIM1_ETR) 25(PA15/SPI1_NSS/USRT2_RX) 26(PB3/SPI1_SCK/EVENTOUT/USART5_TX) 27(SPI1_MISO/TIM3_CH1/EVENTOUT/TIM17_BKIN5/USART5_RX) 28(SPI1_MOSI/I2C1_SMBA/TIM16_BKIN/TIM3_CH2/USART5_CK_RTS/WKUP6) 29(PB6/I2C1_SCL/USRT1_TX/TIM16_CH1N) 30(PB7/I2C1_SDA/USART1_RX/TIM17_CH1N/USART4_CTS); U11 9(QH'); U12 6(QG) 9(QH'); U13 9(QH'); U14 9(QH'); U15 9(QH'); U16 9(QH')

## Notes on the sheet
- (in symbol STM32F030K6T6_QFP32) STM32F030 LQFP-32
- (in symbol VREG_1117_TO252) 1117

## Library data of the parts
C1 C2 = CAP_SMD_EL: CAP, SMD, ELEC,; MANF_P#: MANF_PART#; PARAM2: -V; DESC: DESCRIPTION; DIST#: MOUSER; PARAM: 20%; PRICE: 10= -$; MANF: MANF; ASSEMBLY: ASSEMBLY; VALUE: 1000uF
C3 C6 C8 C10 = CAP_SMD_MLCC: CAP, MLCC; PARAM: C0G, 10%; DESC: CAP, MLCC, 1nF, 50V, C0G, 10%, 0402; MANF_P#: MANF_PART#; MANF: Murata; PARAM2: 50V; PRICE: 100= 1$; ASSEMBLY: ASSEMBLY
  C3 C6: VALUE: 100nF
  C8 C10: VALUE: 20pF
C4 C5 C7 C9 C11-C16 = CAP SMD PACKAGE: TOTAL CAPACITOR SMD PACK; Designer: Abbas Basereh; Category: Capacitor; Package: all package
D1 = LED_SMD_1206_YLW: LED, SMD, 1206, YELLOW; DESC: DESCRIPTION; MANF_P#: MANF_PART#; PARAM2: 2.2V; MANF: MANF; ASSEMBLY: ASSEMBLY; PRICE: 36t@Javan; VALUE: LED1206YLW
D2 D5 D8 D11 D14 D17 D20 D24 D27 D30 D33 D36 D39 = LED_THD_3MM: LED, THD, 3MM, GREEN; DESC: DESCRIPTION; MANF_P#: MANF_PART#; PARAM2: 2.2V; MANF: MANF; ASSEMBLY: ASSEMBLY; PRICE: PRICE
  D2 D5 D8 D11 D14 D20 D24 D27 D30 D36 D39: VALUE: LED3MM
D?#1 D?#3 D?#5 D?#7 D?#9 D?#11 D?#14 D?#16 D?#18 D?#20 D?#22 D?#24 D?#26 = LED_THD_5MM_RED: LED, THD, 5MM, RED; DESC: DESCRIPTION; MANF_P#: MANF_PART#; PARAM2: 2.2V; MANF: MANF; ASSEMBLY: ASSEMBLY; PRICE: PRICE; VALUE: LED5MM_RED
D?#2 D?#4 D?#6 D?#8 D?#10 D?#12 D?#13 D?#15 D?#17 D?#19 D?#21 D?#23 D?#25 D?#27 = LED_THD_5MM_YLW: LED, THD, 5MM, YELLOW; DESC: DESCRIPTION; MANF_P#: MANF_PART#; PARAM2: 2.2V; MANF: MANF; ASSEMBLY: ASSEMBLY; PRICE: PRICE; VALUE: LED5MM_YLW
J1 = CONN_PWR_JACKR2: CONN, PWR JACK DC, PLUG DIAM 2.0MM RA THD; MANF: CUI STACK; MANF_P#: PJ-202A, PJ-002AH, PJ-102AH, KLDX-0202; VALUE: DC_POWER_JACK
J2 = CONN_MSTB_4: CONN, PHOENIX MSTB, 5-G, 5.08mm pitch; PARAM2: 320V; PARAM: 12A; VALUE: CONN_TB4
J3 = HDR_F_1X6: CONN, HEADER, Female, pitch: 2.54mm, 6POS; VALUE: HDRF6
J4 = HDR_F_1X5: CONN, HEADER, Female, pitch: 2.54mm, 5POS; VALUE: HDRF5
J5 = CONN_MSTB_10: MSTB, 5-G, 5.08mm pitch; PARAM2: 320V; PARAM: 12A; VALUE: CONN_TB10
J6-J8 = CONN_MSTB_10: CONN, PHOENIX MSTB, 5-G, 5.08mm pitch; PARAM2: 320V; PARAM: 12A; VALUE: CONN_TB10
J9 = CONN_MSTB_2: CONN, PHOENIX MSTB, 5-G, 5.08mm pitch; PARAM2: 320V; PARAM: 12A; VALUE: CONN_TB2
M1-M8 = SCMH_M5FT: SCREW mouting, M5, 5mm diameter and 10.0mm, FlatHead; ASSEMBLY: DNP; VALUE: DNP/MH
Q2-Q10 = NPN_BC847_SOT23: BJT, NPN, 45v, 0.1A, SOT23; PARAM: 0.1A, Hfe110~800; PARAM2: 45v, 500mW; MANF_P#: BC847BLT; MANF: NXP, ON; VALUE: BC847
R3 = RES_THD_POT_7X5: RESISTOR, THD, Potentiometer; VALUE: POT10K
R4-R69 = RES_SMD: RESISTOR, SMD; PARAM: -W; DESC: DESCRIPTION; DIST#: MOUSER; PARAM2: 1%; MANF_P#: -; MANF: -; ASSEMBLY: ASSEMBLY; PRICE: 100= 0.5$
  R4 R6 R9 R16 R17 R23 R25: VALUE: 4.7k
  R5 R7 R8 R10: VALUE: 330
  R11 R13 R15 R22 R28: VALUE: 4.7K
  R12: VALUE: 1K
  R14 R18 R19 R21 R24 R26 R27 R29-R36 R38-R69: VALUE: 1k
  R20: VALUE: 10K
U2 U6 U8 U9 U11-U16 = 74HC595_SOP16: Shift Register, 8-Bit, with 3-State Output Registers; MANF: DIODES, ON, NXP; MANF_P#: 74HC595S16, 74HC595DR2G, 74HC595D; PARAM2: 2~6VIN; PARAM: 8mA
  U8 U9 U14 U15: VALUE: 74HC595
U3 = VREG_1117_TO252: REG, Linear, LDO1V, 0.8A, TO-252; MANF_P#: LM1117, LD1117, NCV1117; MANF: TI, ON, ST; PARAM2: 1.2/1.5/1.8/2.5/2.85/3.3/5V; PARAM: LDO1V, 0.8A; VALUE: LD1117
U4 U5 U7 = OPTC_TR4P_PC817: OPTOCOUPLER, TRANSISTOR, 4PIN; PARAM: IF=20mA; PARAM2: VCE = 35V; MANF: SHARP; MANF_P#: PC817; PRICE: -; VALUE: PC817; PACKAGE: DIP-4
U10 = STM32F030K6T6_QFP32: MCU, STM32 ARM 32-bit, Cortex-M0, 64 KB Flash, 8 KB RAM, 39 I/Os, LQFP-48; MANF: ST; PARAM: 64KB FLASH, 8KB SRAM, -40~85oC; MANF_P#: STM32F030K6T6; VALUE: STM32F030; PACKAGE: QFP-48
X1 = XTL_2_HC49_8MHz_SMD: Crystal MOST POPULAR ABL HC49 PACKAGE; MANF: ABRACON; MANF_P#: ABLS-8.000MHZ-B4-T; PARAM: 8MHz, 18pF, 30PPM, -20~70oC; PRICE: 0.3$; VALUE: XTL_8MHz